# EAGLE design bbb_d300_cape (EAGLE 7.7.0)
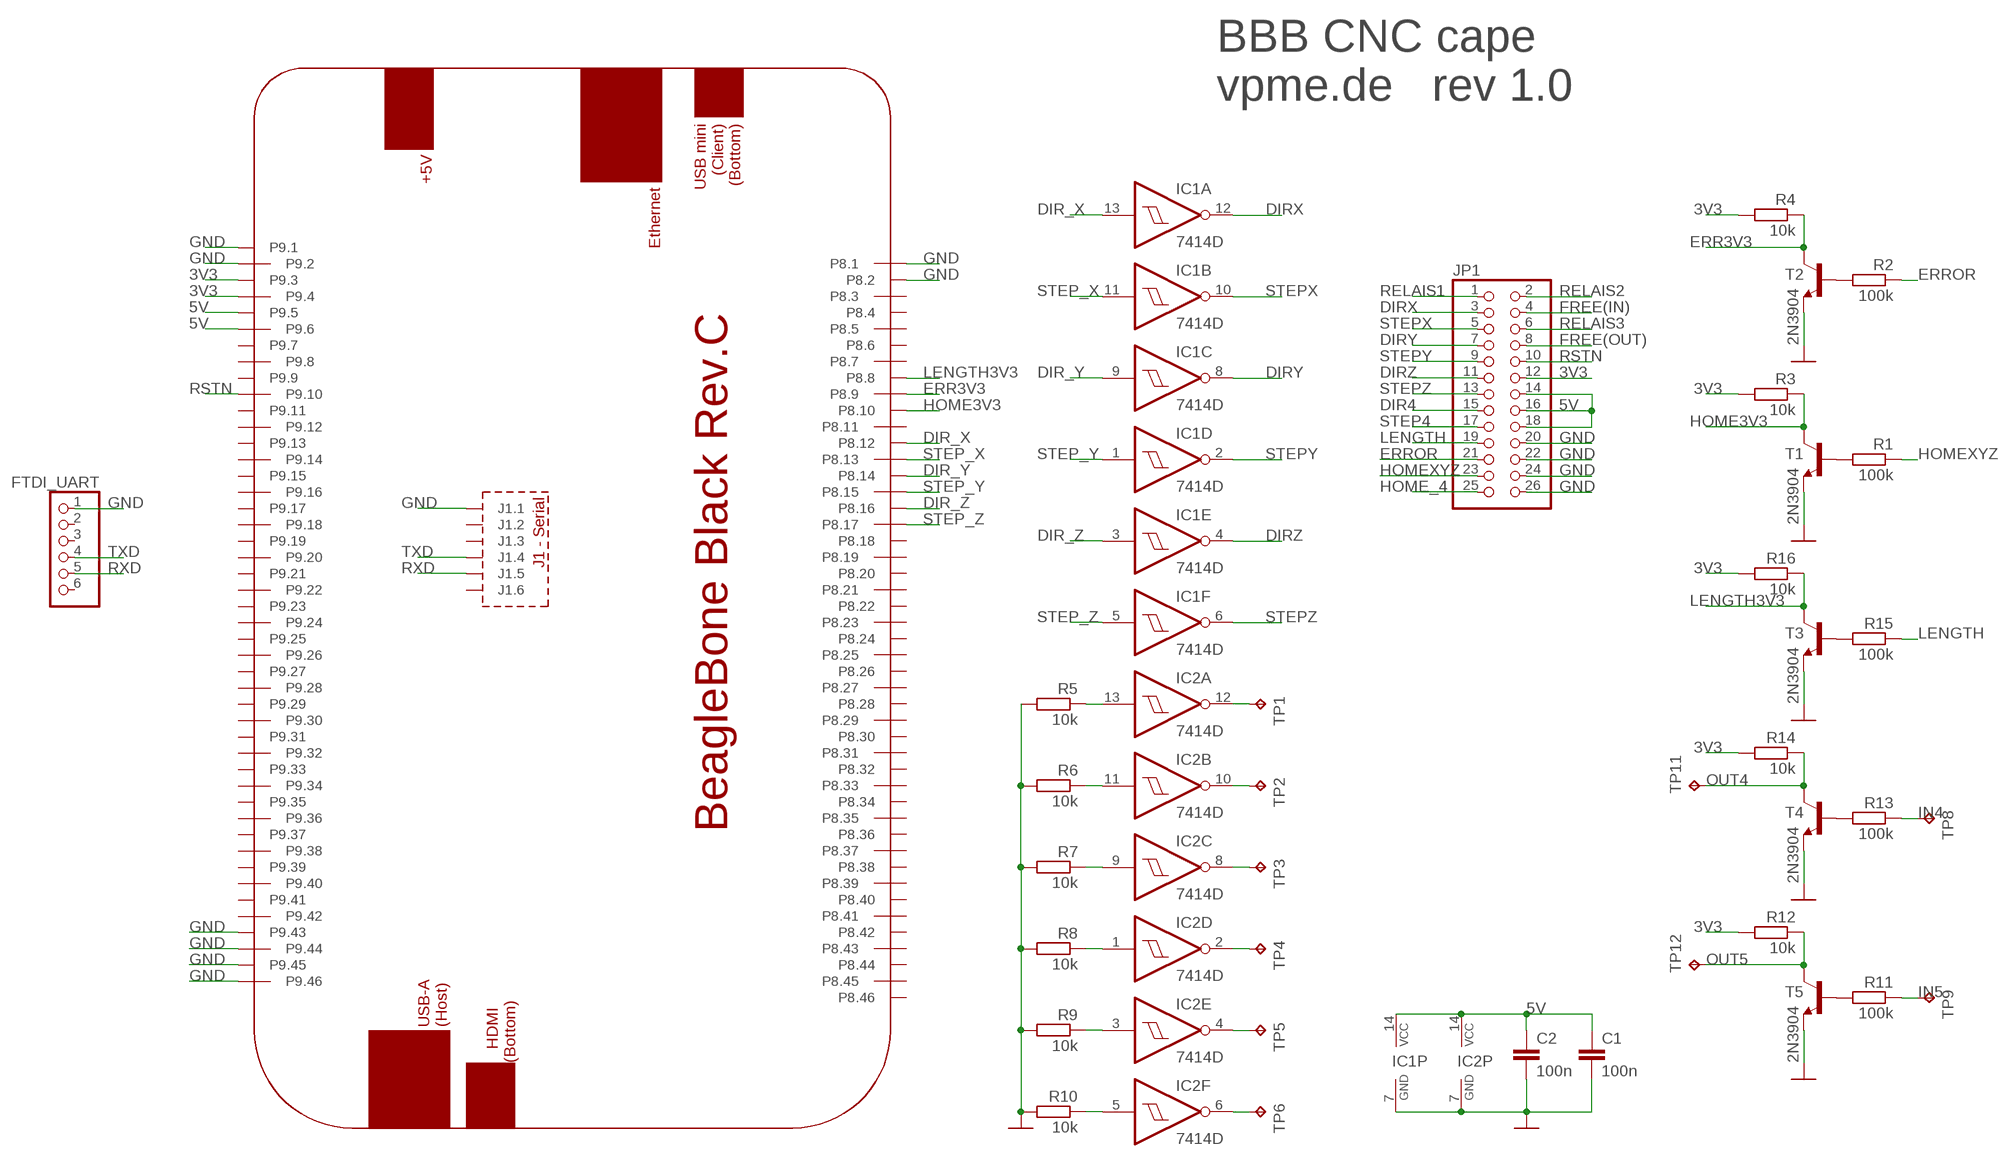
[diagram p0: schematic, sheet 1]

## Parts
C1  100n  C-EUC0603  [C0603]
C2  100n  C-EUC0603  [C0603]
FTDI_UART  PINHD-1X6/90  [1X06/90]
IC1  7414D  [SO14]
IC2  7414D  [SO14]
JP1  PINHD-2X13/90  [2X13/90]
PCB2  BEAGLEBONE_BLACK_CAPE  [BEAGLEBONE_BLACK_CAPE]
R1  100k  R-EU_R0603  [R0603]
R2  100k  R-EU_R0603  [R0603]
R3  10k  R-EU_R0603  [R0603]
R4  10k  R-EU_R0603  [R0603]
R5  10k  R-EU_R0603  [R0603]
R6  10k  R-EU_R0603  [R0603]
R7  10k  R-EU_R0603  [R0603]
R8  10k  R-EU_R0603  [R0603]
R9  10k  R-EU_R0603  [R0603]
R10  10k  R-EU_R0603  [R0603]
R11  100k  R-EU_R0603  [R0603]
R12  10k  R-EU_R0603  [R0603]
R13  100k  R-EU_R0603  [R0603]
R14  10k  R-EU_R0603  [R0603]
R15  100k  R-EU_R0603  [R0603]
R16  10k  R-EU_R0603  [R0603]
T1  2N3904  MMBT2222ALT1-NPN-SOT23-BEC  [SOT23-BEC]
T2  2N3904  MMBT2222ALT1-NPN-SOT23-BEC  [SOT23-BEC]
T3  2N3904  MMBT2222ALT1-NPN-SOT23-BEC  [SOT23-BEC]
T4  2N3904  MMBT2222ALT1-NPN-SOT23-BEC  [SOT23-BEC]
T5  2N3904  MMBT2222ALT1-NPN-SOT23-BEC  [SOT23-BEC]
TP1  TPTP12R  [TP12R]
TP2  TPTP12R  [TP12R]
TP3  TPTP12R  [TP12R]
TP4  TPTP12R  [TP12R]
TP5  TPTP12R  [TP12R]
TP6  TPTP12R  [TP12R]
TP8  TPTP12R  [TP12R]
TP9  TPTP12R  [TP12R]
TP11  TPTP12R  [TP12R]
TP12  TPTP12R  [TP12R]

## Nets
3V3: JP1.12 PCB2.P9.3 PCB2.P9.4 R3.2 R4.2 R12.2 R14.2 R16.2
5V: C1.1 C2.1 IC1.14(P:VCC) IC2.14(P:VCC) JP1.14 JP1.16 JP1.18 PCB2.P9.5 PCB2.P9.6
DIR4: JP1.15
DIR_X: IC1.13(A:I) PCB2.P8.12
DIR_Y: IC1.9(C:I) PCB2.P8.14
DIR_Z: IC1.3(E:I) PCB2.P8.16
DIRX: IC1.12(A:O) JP1.3
DIRY: IC1.8(C:O) JP1.7
DIRZ: IC1.4(E:O) JP1.11
ERR3V3: PCB2.P8.9 R4.1 T2.C
ERROR: JP1.21 R2.1
FREE(IN): JP1.4
FREE(OUT): JP1.8
GND: C1.2 C2.2 FTDI_UART.1 IC1.7(P:GND) IC2.7(P:GND) JP1.20 JP1.22 JP1.24 JP1.26 PCB2.J1.1 PCB2.P8.1 PCB2.P8.2 PCB2.P9.1 PCB2.P9.2 PCB2.P9.43 PCB2.P9.44 PCB2.P9.45 PCB2.P9.46 R5.2 R6.2 R7.2 R8.2 R9.2 R10.2 T1.E T2.E T3.E T4.E T5.E
HOME3V3: PCB2.P8.10 R3.1 T1.C
HOME_4: JP1.25
HOMEXYZ: JP1.23 R1.1
IN4: R13.1 TP8.TP
IN5: R11.1 TP9.TP
LENGTH: JP1.19 R15.1
LENGTH3V3: PCB2.P8.8 R16.1 T3.C
N$1: IC2.13(A:I) R5.1
N$2: R2.2 T2.B
N$3: IC2.11(B:I) R6.1
N$4: IC2.9(C:I) R7.1
N$5: IC2.1(D:I) R8.1
N$6: IC2.3(E:I) R9.1
N$7: IC2.5(F:I) R10.1
N$8: IC2.6(F:O) TP6.TP
N$9: IC2.4(E:O) TP5.TP
N$10: IC2.2(D:O) TP4.TP
N$11: IC2.8(C:O) TP3.TP
N$12: IC2.10(B:O) TP2.TP
N$13: IC2.12(A:O) TP1.TP
N$14: R11.2 T5.B
N$15: R13.2 T4.B
N$16: R1.2 T1.B
N$17: R15.2 T3.B
OUT4: R14.1 T4.C TP11.TP
OUT5: R12.1 T5.C TP12.TP
RELAIS1: JP1.1
RELAIS2: JP1.2
RELAIS3: JP1.6
RSTN: JP1.10 PCB2.P9.10
RXD: FTDI_UART.5 PCB2.J1.5
STEP4: JP1.17
STEP_X: IC1.11(B:I) PCB2.P8.13
STEP_Y: IC1.1(D:I) PCB2.P8.15
STEP_Z: IC1.5(F:I) PCB2.P8.17
STEPX: IC1.10(B:O) JP1.5
STEPY: IC1.2(D:O) JP1.9
STEPZ: IC1.6(F:O) JP1.13
TXD: FTDI_UART.4 PCB2.J1.4
Unconnected: FTDI_UART.2 FTDI_UART.3 FTDI_UART.6 PCB2.J1.2 PCB2.J1.3 PCB2.J1.6 PCB2.P8.3 PCB2.P8.4 PCB2.P8.5 PCB2.P8.6 PCB2.P8.7 PCB2.P8.11 PCB2.P8.18 PCB2.P8.19 PCB2.P8.20 PCB2.P8.21 PCB2.P8.22 PCB2.P8.23 PCB2.P8.24 PCB2.P8.25 PCB2.P8.26 PCB2.P8.27 PCB2.P8.28 PCB2.P8.29 PCB2.P8.30 PCB2.P8.31 PCB2.P8.32 PCB2.P8.33 PCB2.P8.34 PCB2.P8.35 PCB2.P8.36 PCB2.P8.37 PCB2.P8.38 PCB2.P8.39 PCB2.P8.40 PCB2.P8.41 PCB2.P8.42 PCB2.P8.43 PCB2.P8.44 PCB2.P8.45 PCB2.P8.46 PCB2.P9.7 PCB2.P9.8 PCB2.P9.9 PCB2.P9.11 PCB2.P9.12 PCB2.P9.13 PCB2.P9.14 PCB2.P9.15 PCB2.P9.16 PCB2.P9.17 PCB2.P9.18 PCB2.P9.19 PCB2.P9.20 PCB2.P9.21 PCB2.P9.22 PCB2.P9.23 PCB2.P9.24 PCB2.P9.25 PCB2.P9.26 PCB2.P9.27 PCB2.P9.28 PCB2.P9.29 PCB2.P9.30 PCB2.P9.31 PCB2.P9.32 PCB2.P9.33 PCB2.P9.34 PCB2.P9.35 PCB2.P9.36 PCB2.P9.37 PCB2.P9.38 PCB2.P9.39 PCB2.P9.40 PCB2.P9.41 PCB2.P9.42

## Notes on the sheet
- BBB CNC cape
  vpme.de   rev 1.0

## Library data of the parts
C1 C2 = rcl:C-EU: CAPACITOR, European symbol
FTDI_UART = pinhead:PINHD-1X6: PIN HEADER
IC1 IC2 = 74xx-eu:74*14: Hex schmitt trigger INVERTER
JP1 = pinhead:PINHD-2X13: PIN HEADER
PCB2 = e14_BeagleBoneBlack_RevB:BEAGLEBONE_BLACK_CAPE
R1-R16 = rcl:R-EU_: RESISTOR, European symbol
T1-T5 = transistor-neu-to92:*-NPN-: NPN Transistror
TP1-TP6 TP8 TP9 TP11 TP12 = testpad:TP: Test pad

## Board
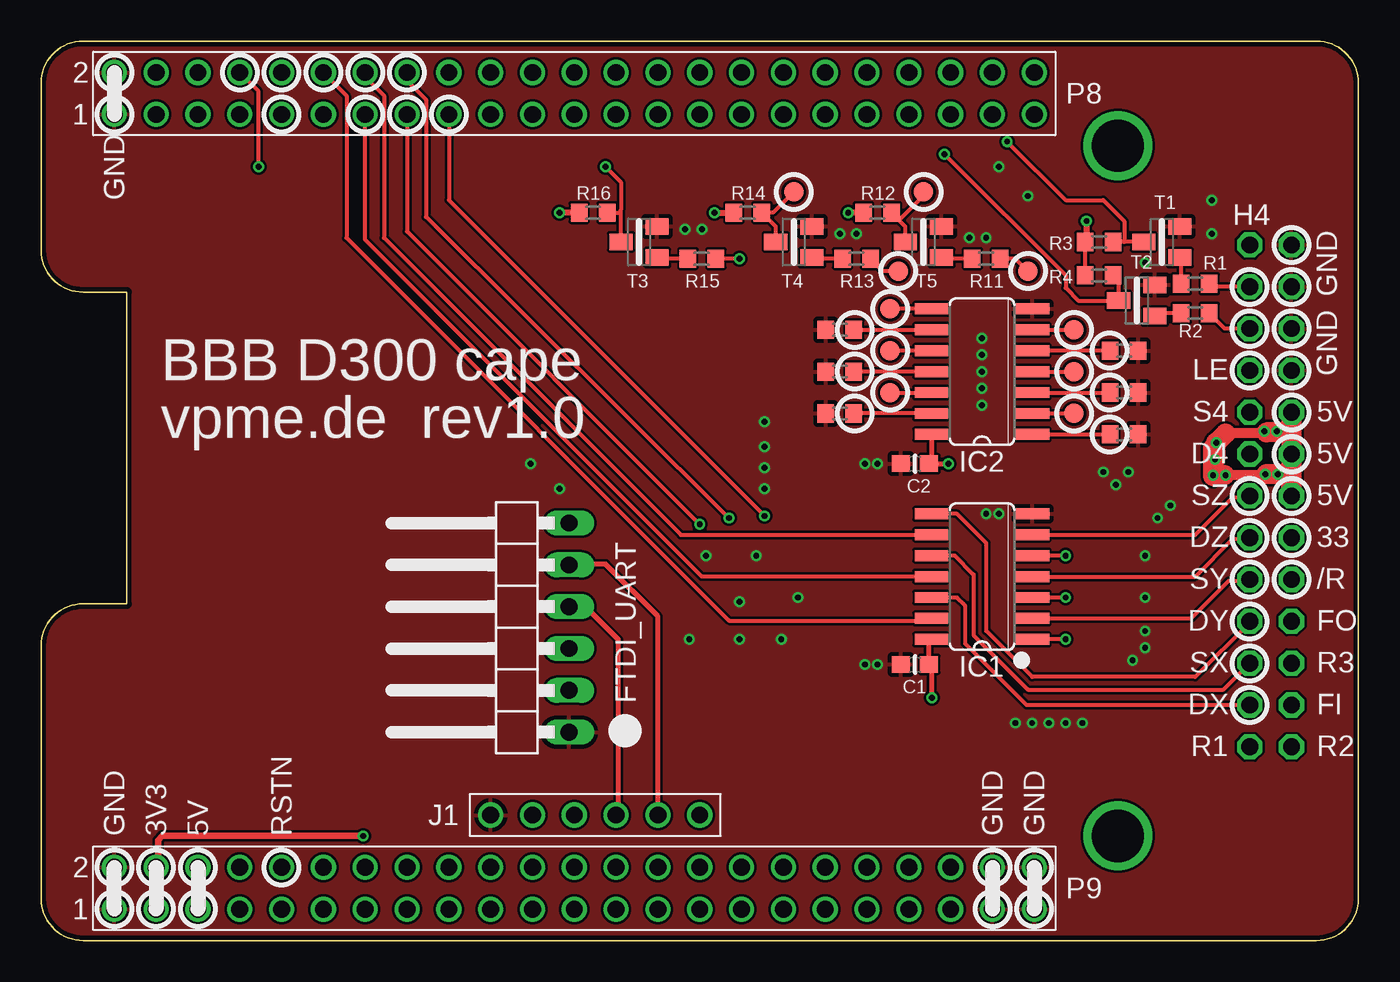
[diagram p1: board, top side]
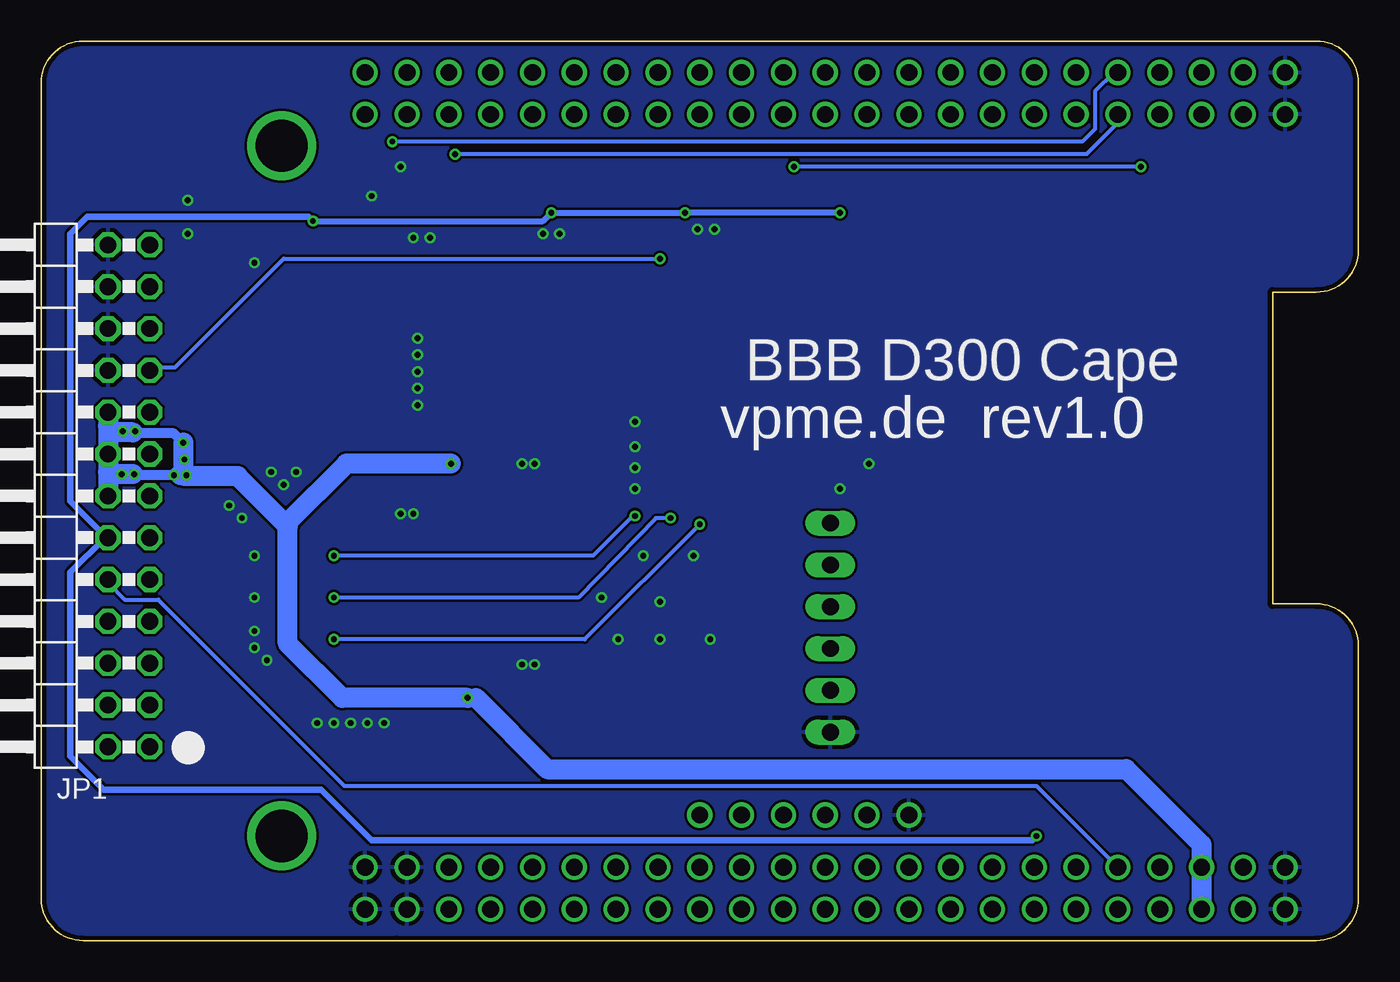
[diagram p2: board, bottom side, seen from below]

Size 80.01 x 54.61 mm. Coordinates in mm from the lower left corner, seen from the top.
Outline: 58.42,54.61 77.47,54.61 arc-90 80.01,52.07 80.01,2.54 arc-90 77.47,0 58.42,0
Copper layers (1*16): Top 0.035mm / dielectric 1.5mm / Bottom 0.035mm
Design rules "dirt_cheap_dirty_boards.v1 *": minimum track width 5mil, minimum drill 12mil, track to track 6mil, track to pad 6mil, pad to pad 6mil, via to via 6mil, smd to smd 0mil, copper to edge 10mil, drill to drill 10mil, minimum pad ring 10mil, minimum via ring 6mil, stop-mask expansion 2mil, vias tented up to drill 25mil, thermal gap 10mil

### Footprints (pad centres in the part's own frame; a part is rotated, then mirrored left to right if it is on the bottom)
C0603 = smd 1.1 x 1: 1 -0.85,0; 2 0.85,0
1X06/90 = drill 1.016 long: 1 -6.35,-3.81; 2 -3.81,-3.81; 3 -1.27,-3.81; 4 1.27,-3.81; 5 3.81,-3.81; 6 6.35,-3.81
SO14 = smd 0.66 x 2.032: 1 -3.81,-3.073; 2 -2.54,-3.073; 3 -1.27,-3.073; 4 0,-3.073; 5 1.27,-3.073; 6 2.54,-3.073; 7 3.81,-3.073; 8 3.81,3.073; 9 2.54,3.073; 10 1.27,3.073; 11 0,3.073; 12 -1.27,3.073; 13 -2.54,3.073; 14 -3.81,3.073
2X13/90 = drill 1.016 octagon: 1 -15.24,-6.35; 2 -15.24,-3.81; 3 -12.7,-6.35; 4 -12.7,-3.81; 5 -10.16,-6.35; 6 -10.16,-3.81; 7 -7.62,-6.35; 8 -7.62,-3.81; 9 -5.08,-6.35; 10 -5.08,-3.81; 11 -2.54,-6.35; 12 -2.54,-3.81; 13 0,-6.35; 14 0,-3.81; 15 2.54,-6.35; 16 2.54,-3.81; 17 5.08,-6.35; 18 5.08,-3.81; 19 7.62,-6.35; 20 7.62,-3.81; 21 10.16,-6.35; 22 10.16,-3.81; 23 12.7,-6.35; 24 12.7,-3.81; 25 15.24,-6.35; 26 15.24,-3.81
BEAGLEBONE_BLACK_CAPE = drill 3.175: H2 80.645,6.35; H3 80.645,48.26 | drill 1.016: J1.1 42.545,7.62; J1.2 45.085,7.62; J1.3 47.625,7.62; J1.4 50.165,7.62; J1.5 52.705,7.62; J1.6 55.245,7.62; P8.1 19.685,50.165; P8.2 19.685,52.705; P8.3 22.225,50.165; P8.4 22.225,52.705; P8.5 24.765,50.165; P8.6 24.765,52.705; P8.7 27.305,50.165; P8.8 27.305,52.705; P8.9 29.845,50.165; P8.10 29.845,52.705; P8.11 32.385,50.165; P8.12 32.385,52.705; P8.13 34.925,50.165; P8.14 34.925,52.705; P8.15 37.465,50.165; P8.16 37.465,52.705; P8.17 40.005,50.165; P8.18 40.005,52.705; P8.19 42.545,50.165; P8.20 42.545,52.705; P8.21 45.085,50.165; P8.22 45.085,52.705; P8.23 47.625,50.165; P8.24 47.625,52.705; P8.25 50.165,50.165; P8.26 50.165,52.705; P8.27 52.705,50.165; P8.28 52.705,52.705; P8.29 55.245,50.165; P8.30 55.245,52.705; P8.31 57.785,50.165; P8.32 57.785,52.705; P8.33 60.325,50.165; P8.34 60.325,52.705; P8.35 62.865,50.165; P8.36 62.865,52.705; P8.37 65.405,50.165; P8.38 65.405,52.705; P8.39 67.945,50.165; P8.40 67.945,52.705; P8.41 70.485,50.165; P8.42 70.485,52.705; P8.43 73.025,50.165; P8.44 73.025,52.705; P8.45 75.565,50.165; P8.46 75.565,52.705; P9.1 19.685,1.905; P9.2 19.685,4.445; P9.3 22.225,1.905; P9.4 22.225,4.445; P9.5 24.765,1.905; P9.6 24.765,4.445; P9.7 27.305,1.905; P9.8 27.305,4.445; P9.9 29.845,1.905; P9.10 29.845,4.445; P9.11 32.385,1.905; P9.12 32.385,4.445; P9.13 34.925,1.905; P9.14 34.925,4.445; P9.15 37.465,1.905; P9.16 37.465,4.445; P9.17 40.005,1.905; P9.18 40.005,4.445; P9.19 42.545,1.905; P9.20 42.545,4.445; P9.21 45.085,1.905; P9.22 45.085,4.445; P9.23 47.625,1.905; P9.24 47.625,4.445; P9.25 50.165,1.905; P9.26 50.165,4.445; P9.27 52.705,1.905; P9.28 52.705,4.445; P9.29 55.245,1.905; P9.30 55.245,4.445; P9.31 57.785,1.905; P9.32 57.785,4.445; P9.33 60.325,1.905; P9.34 60.325,4.445; P9.35 62.865,1.905; P9.36 62.865,4.445; P9.37 65.405,1.905; P9.38 65.405,4.445; P9.39 67.945,1.905; P9.40 67.945,4.445; P9.41 70.485,1.905; P9.42 70.485,4.445; P9.43 73.025,1.905; P9.44 73.025,4.445; P9.45 75.565,1.905; P9.46 75.565,4.445
R0603 = smd 1 x 1.1: 1 -0.85,0; 2 0.85,0
SOT23-BEC = smd 1 x 1.4: B -0.95,-1.1; C 0,1.1; E 0.95,-1.1
TP12R = smd 1.2 x 1.2: TP 0,0

### Placement (x,y rotation side)
C1  53.09,16.76 180 top
C2  53.09,28.96 180 top
FTDI_UART  28.26,19 90 top
IC1  57.15,22.1 90 top
IC2  57.15,34.54 90 top
JP1  79.76,27 90 bottom
PCB2  -15.24,0 0 top
R1  70.1,39.88 180 top
R2  70.1,38.1 180 top
R3  64.26,42.42 180 top
R4  64.26,40.39 180 top
R5  48.51,32 180 top
R6  48.51,34.54 180 top
R7  48.51,37.08 180 top
R8  65.79,30.73 0 top
R9  65.79,33.27 0 top
R10  65.79,35.81 0 top
R11  57.4,41.4 180 top
R12  50.8,44.2 180 top
R13  49.53,41.4 180 top
R14  42.93,44.2 180 top
R15  40.13,41.4 180 top
R16  33.53,44.2 180 top
T1  68.07,42.42 90 top
T2  66.55,38.86 90 top
T3  36.32,42.42 90 top
T4  45.72,42.42 90 top
T5  53.59,42.42 90 top
TP1  51.56,33.27 90 top
TP2  51.56,35.81 90 top
TP3  51.56,38.35 90 top
TP4  62.74,32 90 top
TP5  62.74,34.54 90 top
TP6  62.74,37.08 90 top
TP8  52.07,40.64 270 top
TP9  59.94,40.64 270 top
TP11  45.72,45.47 270 top
TP12  53.59,45.47 270 top

### Tracks (layer width: path | path; a pad name or v marks a point on that pad's centre or on a via)
3V3  (via drill 0.36)
  Top 0.254: R3.2 R4.2
  Top 0.356: v63.5,43.69 63.5,42.51 | R16.2 v31.5,44.2 | v40.89,44.2 R14.2 | R12.2 v49.02,44.2
  Top 0.406: 63.5,42.51 R3.2 | v19.56,6.35 7.37,6.35 7.11,6.1 7.11,4.57 PCB2.P9.4 PCB2.P9.3
  Bottom 0.356: 63.75,43.94 v63.5,43.69 49.53,43.69 v49.02,44.2 v40.89,44.2 v31.5,44.2
  Bottom 0.406: 63.75,43.94 77.22,43.94 78.23,42.93 78.23,26.67 76.02,24.46 JP1.12 76.12,24.46 78.23,22.35 78.23,11.18 76.2,9.14 62.99,9.14 59.94,6.1 19.81,6.1 v19.56,6.35
5V  (via drill 0.36)
  Top 0.305: v54.1,14.73 54.1,16.6 C1.1 53.94,18.15 IC1.14 | IC2.14 54.08,29.1 C2.1 v55.12,28.96
  Top 0.61: 74.42,28.32 v74.36,28.32 | v74.36,28.32 74.04,28.32 73.98,28.26 v71.95,28.26 71.88,28.26 | 74.42,30.86 74.36,30.8 71.95,30.8 | v75.06,30.92 75.06,30.86 | v74.3,30.92 74.3,30.8 | v75.12,28.32 v74.36,28.32
  Top 1.219: JP1.18 75.95,30.84 | 75.95,30.84 75.95,26.93 75.95,26.92 75.95,28.32 v75.12,28.32 74.42,28.32 | 71.88,28.26 71.25,28.26 71.18,28.19 | 75.95,30.84 75.93,30.86 75.06,30.86 74.42,30.86 | 71.95,30.8 v71.37,30.23 71.37,30.1 71.18,29.91 | 71.18,29.91 v71.18,28.26 | 71.18,29.91 71.31,29.78 v71.31,29.21
  Bottom 0.254: 74.36,30.8 74.3,30.86 v74.3,30.92
  Bottom 0.61: v71.37,30.23 71.95,30.8 74.36,30.8 74.42,30.86 | 71.57,28.26 74.23,28.26 74.42,28.32
  Bottom 0.914: 65.02,25.15 65.15,25.27 | 71.57,28.26 71.76,28.32 | v54.1,14.73 53.59,14.73
  Bottom 1.219: v54.1,14.73 61.72,14.73 65.02,18.03 65.02,25.15 | 71.25,28.19 68.07,28.19 65.15,25.27 61.47,28.96 v55.12,28.96 | 71.25,28.19 71.57,28.26 | 53.59,14.73 49.28,10.41 14.1,10.41 9.53,5.84 PCB2.P9.6 PCB2.P9.5 | v71.37,30.23 71.37,28.32 71.25,28.19 | JP1.18 75.95,31.24 | 75.95,31.24 JP1.16 JP1.14 | 74.42,30.86 75.57,30.86 75.95,31.24 | 74.42,28.32 75.82,28.32 75.95,28.45
DIR_X
  Top 0.254: PCB2.P8.12 18.54,51.31 18.54,42.67 41.78,19.43 53.95,19.43 IC1.13
DIR_Y
  Top 0.254: PCB2.P8.14 19.68,52.45 20.83,51.31 20.83,42.67 38.86,24.64 IC1.9
DIR_Z  (via drill 0.36)
  Top 0.254: PCB2.P8.16 22.23,52.2 23.37,51.05 23.37,43.94 v41.78,25.65 | v62.23,20.83 IC1.3
  Bottom 0.254: v41.78,25.65 42.67,25.65 47.37,20.83 v62.23,20.83
DIRX
  Top 0.254: JP1.3 59.87,14.3 56.13,18.03 56.13,20.32 55.63,20.83 IC1.12
DIRY
  Top 0.254: JP1.7 73.41,19.31 70.1,16 60.2,16 57.4,18.8 57.4,24.13 55.63,25.91 IC1.8
DIRZ
  Top 0.254: IC1.4 70.1,22.1 72.39,24.38 73.33,24.38 JP1.11
ERR3V3  (via drill 0.36)
  Top 0.254: R4.1 65.45,40.05 T2.C 62.99,38.86 62.23,39.62 62.23,40.39 v54.86,47.75
  Bottom 0.254: PCB2.P8.9 14.6,49.66 16.51,47.75 v54.86,47.75
ERROR
  Top 0.254: JP1.21 71.89,37.16 R2.1
GND  (via drill 0.36)
  other vias: 43.94,31.5 57.15,34.54 57.15,35.56 57.15,36.58 57.15,33.53 57.15,32.51 57.4,25.91 58.17,25.91 43.94,27.43 43.94,28.7 43.94,29.97 40.39,23.37 43.43,23.37 42.42,20.57 45.97,20.83 44.96,18.29 42.42,18.29 39.37,18.29 31.5,27.43 29.72,28.96 39.12,43.18 40.13,43.18 48.51,42.93 49.53,42.93 56.39,42.67 57.4,42.67 71.12,42.93 71.12,44.96 67.06,41.15 59.94,45.21 58.17,46.99 65.28,27.69 66.04,28.45 64.52,28.45 68.58,26.42 67.82,25.65 67.06,23.37 67.06,20.83 67.06,18.8 67.06,17.78 66.29,17.02 63.25,13.21 62.23,13.21 61.21,13.21 60.2,13.21 59.18,13.21 50.8,16.76 50.04,16.76 50.8,28.96 50.04,28.96
  pour Top: 0,0 0,54.61 80.01,54.61 80.01,0
  pour Bottom: 0,54.61 0,0 80.01,0 80.01,54.61
HOME3V3  (via drill 0.36)
  Top 0.254: T1.C 65.79,42.42 | 65.79,42.42 R3.1 | v58.67,48.51 62.23,44.96 64.52,44.96 65.79,43.69 65.79,42.42
  Bottom 0.254: PCB2.P8.10 14.86,52.7 16,51.56 16,49.28 16.76,48.51 v58.67,48.51
HOMEXYZ
  Top 0.254: JP1.23 71.13,39.7 R1.1
IN4
  Top 0.254: TP8.TP 51.14,40.64 R13.1
IN5
  Top 0.254: TP9.TP 59.18,41.4 R11.1
LENGTH  (via drill 0.36)
  Top 0.254: v42.42,41.4 R15.1
  Bottom 0.254: v42.42,41.4 65.28,41.4 71.88,34.8 73.23,34.8 JP1.19
LENGTH3V3  (via drill 0.36)
  Top 0.254: T3.C 35.22,44.37 | R16.1 35.14,44.2 35.22,44.37 | v34.29,46.99 35.22,46.06 35.22,44.37 | v13.21,46.99 13.21,51.56 PCB2.P8.8
  Bottom 0.254: v13.21,46.99 v34.29,46.99
N$1
  Top 0.254: IC2.13 R5.1
N$2
  Top 0.254: R2.2 67.84,38.1 T2.B
N$3
  Top 0.254: IC2.11 R6.1
N$4
  Top 0.254: R7.1 IC2.9
N$5
  Top 0.254: IC2.1 R8.1
N$6
  Top 0.254: IC2.3 R9.1
N$7
  Top 0.254: R10.1 IC2.5
N$8
  Top 0.254: IC2.6 TP6.TP
N$9
  Top 0.254: IC2.4 TP5.TP
N$10
  Top 0.254: IC2.2 TP4.TP
N$11
  Top 0.254: IC2.8 TP3.TP
N$12
  Top 0.254: IC2.10 TP2.TP
N$13
  Top 0.254: TP1.TP IC2.12
N$14
  Top 0.254: R11.2 54.76,41.4 T5.B
N$15
  Top 0.254: R13.2 46.89,41.4 T4.B
N$16
  Top 0.254: R1.2 69.25,41.39 T1.B
N$17
  Top 0.254: R15.2 37.49,41.4 T3.B
OUT4
  Top 0.254: TP11.TP 44.45,44.2 R14.1 44.62,43.35 T4.C
OUT5
  Top 0.254: T5.C 52.49,43.35 52.11,43.73 | 52.11,43.73 R12.1 | TP12.TP 53.59,45.21 52.11,43.73
RSTN
  Bottom 0.254: JP1.10 75.95,21.72 74.93,20.7 72.9,20.7 61.59,9.4 19.56,9.4 PCB2.P9.10
RXD
  Top 0.305: PCB2.J1.5 37.46,19.68 34.29,22.86 32.12,22.86 FTDI_UART.5
STEP_X
  Top 0.254: IC1.11 40.13,22.1 19.68,42.55 PCB2.P8.13
STEP_Y  (via drill 0.36)
  Top 0.254: v62.23,18.29 IC1.1 | PCB2.P8.15 22.23,43.05 v40,25.27
  Bottom 0.254: v40,25.27 46.99,18.29 v62.23,18.29
STEP_Z  (via drill 0.36)
  Top 0.254: v62.23,23.37 IC1.5 | PCB2.P8.17 24.77,44.96 v43.94,25.78
  Bottom 0.254: v43.94,25.78 44.07,25.78 46.48,23.37 v62.23,23.37
STEPX
  Top 0.254: 54.1,23.37 IC1.10 55.5,23.37 56.64,22.23 56.64,18.54 59.94,15.24 71.81,15.24 JP1.5
STEPY
  Top 0.254: IC1.2 69.85,19.56 72.14,21.84 73.33,21.84 JP1.9
STEPZ
  Top 0.254: IC1.6 70.1,24.64 72.39,26.92 73.33,26.92 JP1.13
TXD
  Top 0.305: FTDI_UART.4 33.07,20.27 35.05,18.29 35.05,7.75 PCB2.J1.4

### Text on the board
tPlace: GND | H4 | GND | BBB D300 cape | LE | GND | S4 | 5V | vpme.de rev1.0 | D4 | 5V | SZ | 5V | DZ | 33 | SY | /R | DY | FO | SX | R3 | DX | FI | R1 | R2 | GND | 3V3 | 5V | RSTN | GND | GND
bPlace: BBB D300 Cape | vpme.de rev1.0